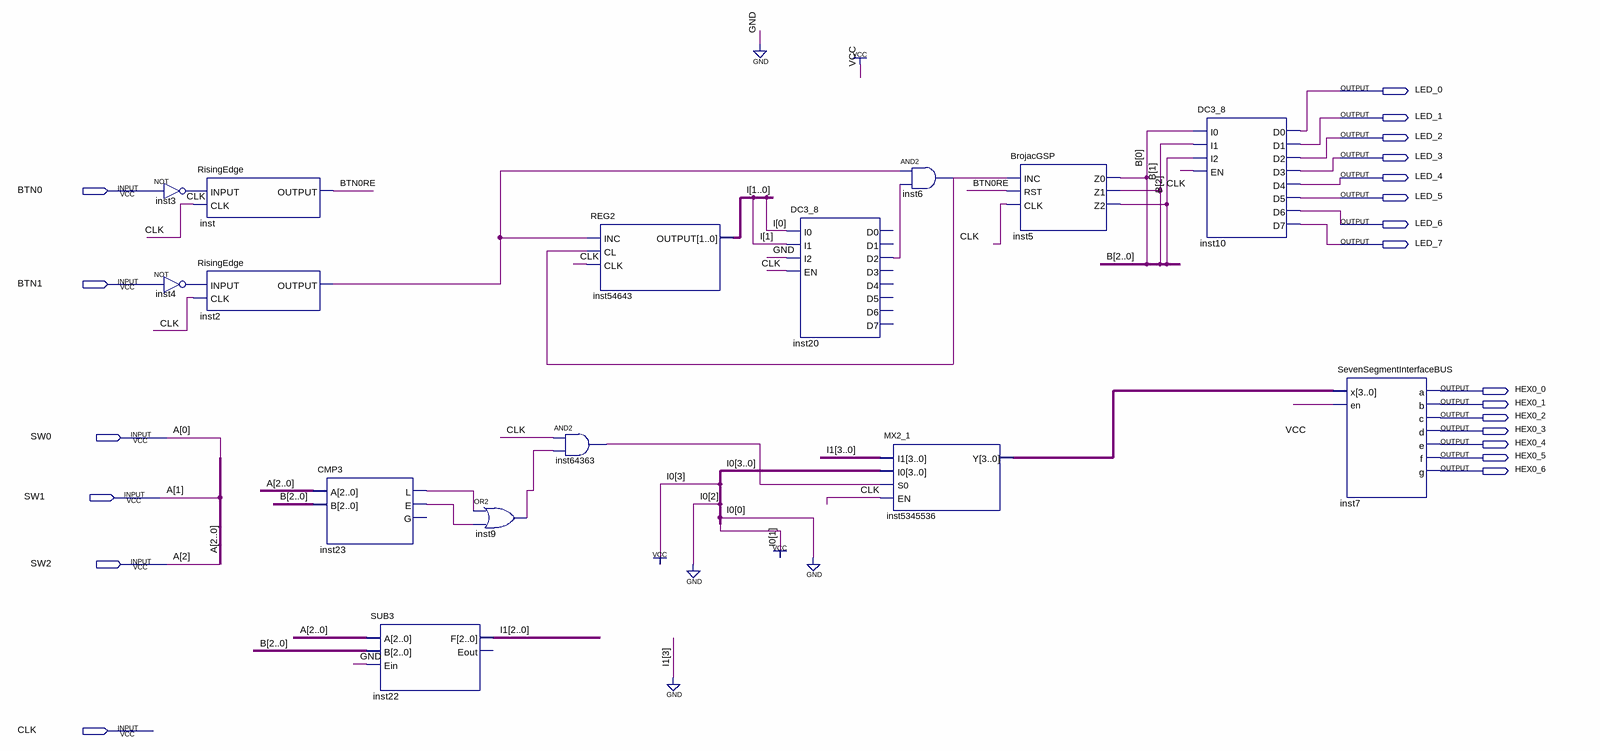
[diagram p0: schematic sheet]
// Quartus schematic DZ3PORT.bdf as structural Verilog: 15 symbols, 21 pins
module DZ3PORT (
  input  BTN0,
  input  BTN1,
  input  SW0,
  input  SW1,
  input  SW2,
  input  CLK,
  output LED_0,
  output LED_1,
  output LED_2,
  output LED_3,
  output LED_4,
  output LED_5,
  output LED_6,
  output LED_7,
  output HEX0_0,
  output HEX0_1,
  output HEX0_2,
  output HEX0_3,
  output HEX0_4,
  output HEX0_5,
  output HEX0_6
);

  wire BTN0RE, inst2_output, inst3_out, inst4_out, inst6_out, inst9_out, inst20_d2, inst23_e, inst23_l,
       inst64363_out;
  wire [1:0] I;
  wire [2:0] B, I1;
  wire [3:0] inst5345536_y;

  not inst3 (inst3_out, BTN0);
  not inst4 (inst4_out, BTN1);
  RisingEdge inst (.INPUT(inst3_out), .CLK(CLK), .OUTPUT(BTN0RE));
  RisingEdge inst2 (.INPUT(inst4_out), .CLK(CLK), .OUTPUT(inst2_output));
  CMP3 inst23 (.A({SW2, SW1, SW0}), .B(B), .L(inst23_l), .E(inst23_e));  // open: G
  SUB3 inst22 (.A({SW2, SW1, SW0}), .B(B), .Ein(1'b0), .F(I1));  // open: Eout
  or inst9 (inst9_out, inst23_l, inst23_e);
  and inst64363 (inst64363_out, CLK, inst9_out);
  REG2 inst54643 (.INC(inst2_output), .CL(inst6_out), .CLK(CLK), .OUTPUT(I));
  DC3_8 inst20 (.I0(I[0]), .I1(I[1]), .I2(1'b0), .EN(CLK), .D2(inst20_d2));  // open: D0, D1, D3, D4, D5, D6, D7
  and inst6 (inst6_out, inst2_output, inst20_d2);
  MX2_1 inst5345536 (.I1({1'b0, I1}), .I0(4'b1010), .S0(inst64363_out), .EN(CLK), .Y(inst5345536_y));
  BrojacGSP inst5 (.INC(inst6_out), .RST(BTN0RE), .CLK(CLK), .Z0(B[0]), .Z1(B[1]), .Z2(B[2]));
  DC3_8 inst10 (
    .I0(B[0]), .I1(B[1]), .I2(B[2]), .EN(CLK), .D0(LED_0), .D1(LED_1), .D2(LED_2), .D3(LED_3), .D4(LED_4),
    .D5(LED_5), .D6(LED_6), .D7(LED_7));
  SevenSegmentInterfaceBUS inst7 (
    .x(inst5345536_y), .en(1'b1), .a(HEX0_0), .b(HEX0_1), .c(HEX0_2), .d(HEX0_3), .e(HEX0_4), .f(HEX0_5),
    .g(HEX0_6));

  // Other names for the same wires on the sheet: A[2:0] = {SW2, SW1, SW0}
endmodule
